# Altium schematic sheet Expansion_Connector.SchDoc: Expansion connector
size A4; Project: STM32MP15-DISCO PI; Date: Not used; ApprovedBy: Not used; CheckedBy: Not used; Author: Not used; CompanyName: STMicroelectronics; DrawnBy: Not used; Engineer: Not used; Organization: Not used; Address1: Not used; Address2: Not used; Address3: Not used; Address4: Not used; DocumentNumber: 14; Revision: Not used; SheetNumber: 14; SheetTotal: 17; CurrentTime: Not used; CurrentDate: Not used; Time: Not used; DocumentFullPathAndName: Not used; DocumentName: Not used; ModifiedDate: Not used; ImagePath: Not used; ProjectName: Not used; Application_BuildNumber: Not used
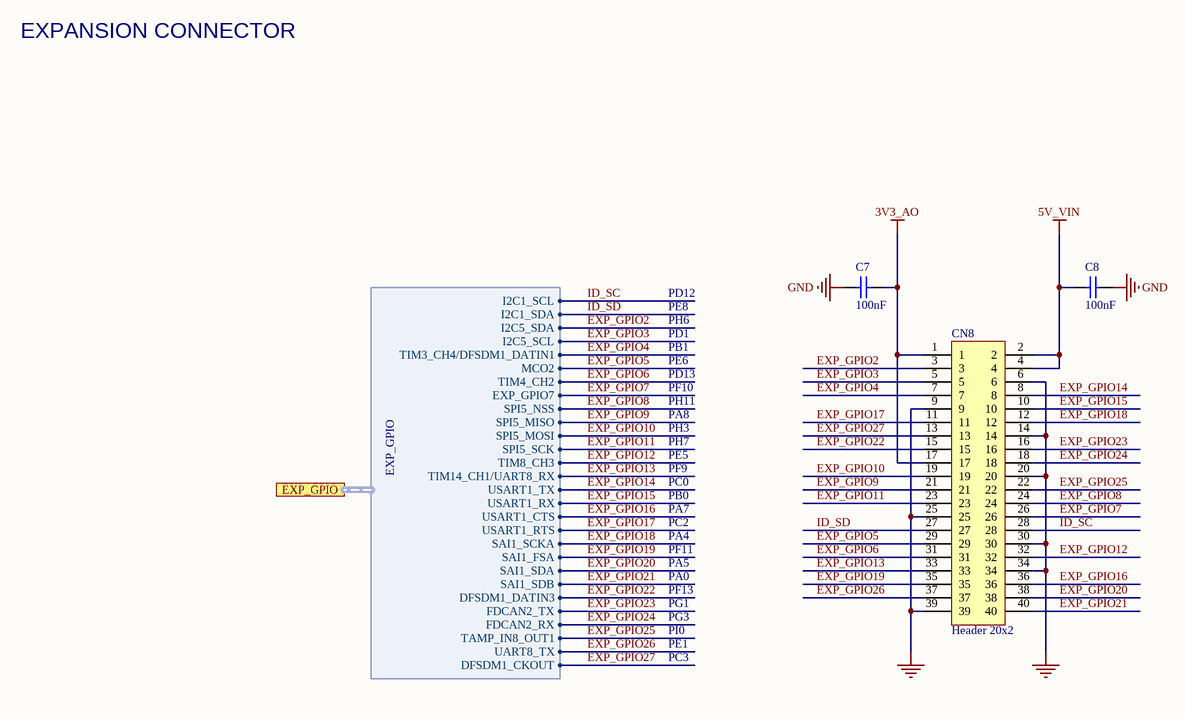
[diagram p0: Expansion_Connector.SchDoc]

## Parts
C7  value 100nF  [C0402]  (hidden comment: Capacitor)
C8  value 100nF  [C0402]  (hidden comment: Capacitor)
CN8  Header 20x2  [CON_SAMTEC_TSW-120-07-G-D]

## Ports
EXP_GPIO (harness EXP_GPIO)

## Harnesses
EXP_GPIO: I2C1_SCL, I2C1_SDA, I2C5_SDA, MCO2, TIM8_CH3, DFSDM1_DATIN3, SPI5_NSS, SPI5_MISO, SPI5_MOSI, SPI5_SCK, TIM4_CH2, USART1_TX, USART1_RX, USART1_CTS, USART1_RTS, UART8_TX, TIM14_CH1/UART8_RX, FDCAN2_TX, FDCAN2_RX, DFSDM1_CKOUT, TIM3_CH4/DFSDM1_DATIN1, I2C5_SCL, SAI1_SCKA, SAI1_FSA, SAI1_SDA, SAI1_SDB, TAMP_IN8_OUT1, EXP_GPIO7

## Nets
3V3_AO: C7.1 CN8.1 CN8.17
5V_VIN: C8.2 CN8.2 CN8.4
GND: C7.2 C8.1 CN8.6 CN8.9 CN8.14 CN8.20 CN8.25 CN8.30 CN8.34 CN8.39
EXP_GPIO2: CN8.3 ; port EXP_GPIO.I2C5_SDA
EXP_GPIO3: CN8.5 ; port EXP_GPIO.I2C5_SCL
EXP_GPIO4: CN8.7 ; port EXP_GPIO.TIM3_CH4/DFSDM1_DATIN1
EXP_GPIO5: CN8.29 ; port EXP_GPIO.MCO2
EXP_GPIO6: CN8.31 ; port EXP_GPIO.TIM4_CH2
EXP_GPIO7: CN8.26 ; port EXP_GPIO.EXP_GPIO7
EXP_GPIO8: CN8.24 ; port EXP_GPIO.SPI5_NSS
EXP_GPIO9: CN8.21 ; port EXP_GPIO.SPI5_MISO
EXP_GPIO10: CN8.19 ; port EXP_GPIO.SPI5_MOSI
EXP_GPIO11: CN8.23 ; port EXP_GPIO.SPI5_SCK
EXP_GPIO12: CN8.32 ; port EXP_GPIO.TIM8_CH3
EXP_GPIO13: CN8.33 ; port EXP_GPIO.TIM14_CH1/UART8_RX
EXP_GPIO14: CN8.8 ; port EXP_GPIO.USART1_TX
EXP_GPIO15: CN8.10 ; port EXP_GPIO.USART1_RX
EXP_GPIO16: CN8.36 ; port EXP_GPIO.USART1_CTS
EXP_GPIO17: CN8.11 ; port EXP_GPIO.USART1_RTS
EXP_GPIO18: CN8.12 ; port EXP_GPIO.SAI1_SCKA
EXP_GPIO19: CN8.35 ; port EXP_GPIO.SAI1_FSA
EXP_GPIO20: CN8.38 ; port EXP_GPIO.SAI1_SDA
EXP_GPIO21: CN8.40 ; port EXP_GPIO.SAI1_SDB
EXP_GPIO22: CN8.15 ; port EXP_GPIO.DFSDM1_DATIN3
EXP_GPIO23: CN8.16 ; port EXP_GPIO.FDCAN2_TX
EXP_GPIO24: CN8.18 ; port EXP_GPIO.FDCAN2_RX
EXP_GPIO25: CN8.22 ; port EXP_GPIO.TAMP_IN8_OUT1
EXP_GPIO26: CN8.37 ; port EXP_GPIO.UART8_TX
EXP_GPIO27: CN8.13 ; port EXP_GPIO.DFSDM1_CKOUT
ID_SC: CN8.28 ; port EXP_GPIO.I2C1_SCL
ID_SD: CN8.27 ; port EXP_GPIO.I2C1_SDA

## Notes on the sheet
- EXPANSION CONNECTOR
- PD12
- PE8
- PB1
- PD1
- PH6
- PE6
- PD13
- PF10
- PA8
- PH3
- PH7
- PH11
- PE5
- PF9
- PA7
- PC0
- PB0
- PF11
- PA4
- PA5
- PA0
- PC2
- PF13
- PG3
- PG1
- PI0
- PE1
- PC3
- Title:
- Project:
- Size:
- Revision:
- Variant:
- A4
- -
- Date:
- Reference:
- Sheet:
- of

## Library data of the parts
C7 C8 = MCD-00006: Capacitor, MLCC, 100nF, 16V, X7R, +/-10%, 0402, T=0.5mm; Part_Preference: Recommended; Manufacturer: YAGEO; Manufacturer_Part_Number: CC0402KRX7R7BB104; Order_Code_RS: 616-9701; Component_Country_Of_Origin: China; ShowFields: YES; ID: 2474; Internal_Part_Number: MCD-00006; Status: Released; Part_Type: Capacitor; Package: 0402; ComponentLink1URL: http://tunmcdsvn.tun.st.com/Component_Documentation_Library/Trunk/Capacitor/YAGEO_X7R_Series; Order_Code_Digikey: 311-1338-1-ND; Order_Code_Farnell: 9402047
CN8 = MCD-00302: Header, 20x2, 2.54mm, VR, TH, T=5.84mm/2.54mm; Manufacturer_Part_Number: TSW-120-07-G-D; Manufacturer: SAMTEC; Part_Type: Connector; Part_Preference: Recommended; Order_Code_RS: 180-2456; Component_Country_Of_Origin: China, Costa Rica, Malaysia, United States, Vietnam; ShowFields: YES; ID: 2567; Internal_Part_Number: MCD-00302; Value: Header 20x2; ComponentLink1URL: http://tunmcdsvn.tun.st.com/Component_Documentation_Library/Trunk/Connector/SAMTEC_TSW_Series/; Status: Released; Order_Code_Digikey: SAM1028-20-ND; Order_Code_Farnell: 2779689